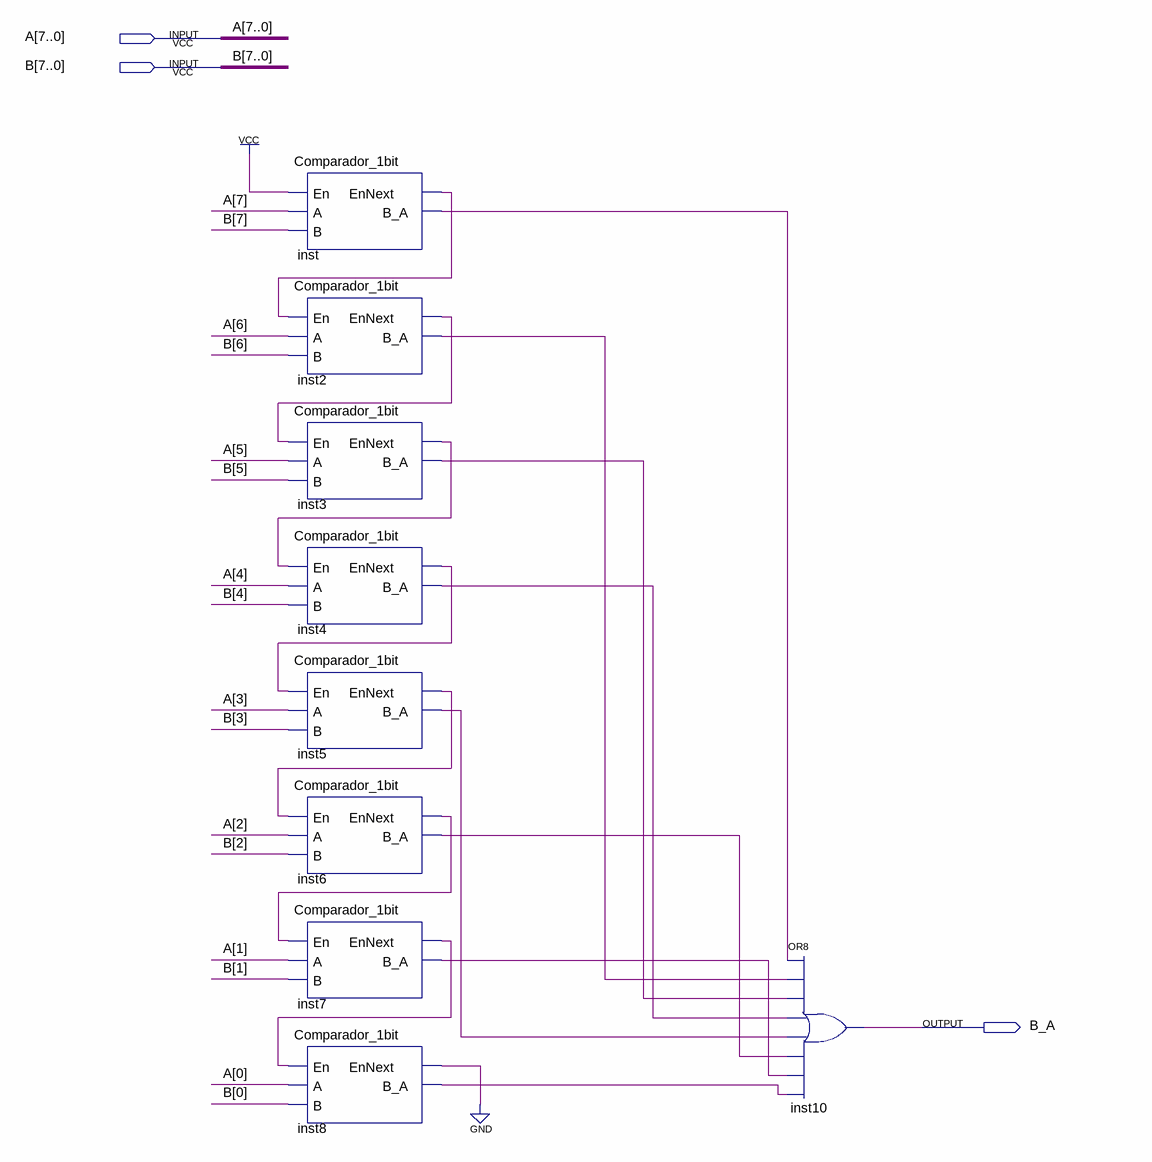
[diagram p0: schematic sheet]
// Quartus schematic Comparador.bdf as structural Verilog: 9 symbols, 3 pins
module Comparador (
  input  [7:0] A,
  input  [7:0] B,
  output B_A
);

  wire inst2_b_a, inst2_ennext, inst3_b_a, inst3_ennext, inst4_b_a, inst4_ennext, inst5_b_a, inst5_ennext,
       inst6_b_a, inst6_ennext, inst7_b_a, inst7_ennext, inst8_b_a, inst8_ennext, inst_b_a, inst_ennext;

  Comparador_1bit inst (.En(1'b1), .A(A[7]), .B(B[7]), .EnNext(inst_ennext), .B_A(inst_b_a));
  Comparador_1bit inst2 (.En(inst_ennext), .A(A[6]), .B(B[6]), .EnNext(inst2_ennext), .B_A(inst2_b_a));
  Comparador_1bit inst3 (.En(inst2_ennext), .A(A[5]), .B(B[5]), .EnNext(inst3_ennext), .B_A(inst3_b_a));
  Comparador_1bit inst4 (.En(inst3_ennext), .A(A[4]), .B(B[4]), .EnNext(inst4_ennext), .B_A(inst4_b_a));
  Comparador_1bit inst5 (.En(inst4_ennext), .A(A[3]), .B(B[3]), .EnNext(inst5_ennext), .B_A(inst5_b_a));
  Comparador_1bit inst6 (.En(inst5_ennext), .A(A[2]), .B(B[2]), .EnNext(inst6_ennext), .B_A(inst6_b_a));
  Comparador_1bit inst7 (.En(inst6_ennext), .A(A[1]), .B(B[1]), .EnNext(inst7_ennext), .B_A(inst7_b_a));
  Comparador_1bit inst8 (.En(inst7_ennext), .A(A[0]), .B(B[0]), .EnNext(inst8_ennext), .B_A(inst8_b_a));
  or inst10 (B_A, inst_b_a, inst2_b_a, inst3_b_a, inst4_b_a, inst5_b_a, inst6_b_a, inst7_b_a, inst8_b_a);
  // also tied to GND on the sheet: inst8_ennext
endmodule
